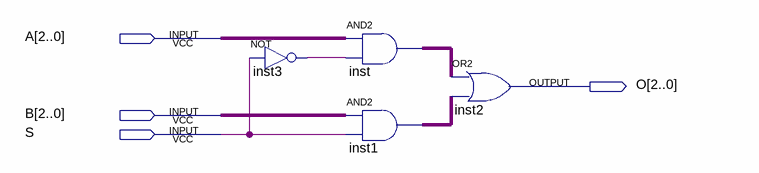
[diagram p0: schematic sheet]
// Quartus schematic 5mux21.bdf as structural Verilog: 4 symbols, 4 pins
module \5mux21  (
  input  [2:0] A,
  input  [2:0] B,
  input  S,
  output [2:0] O
);

  wire inst3_out;
  wire [2:0] inst1_out, inst_out;

  not inst3 (inst3_out, S);
  assign inst_out = A & {3{inst3_out}};  // AND2 inst, 3 bits wide
  assign inst1_out = B & {3{S}};  // AND2 inst1, 3 bits wide
  assign O = inst_out | inst1_out;  // OR2 inst2, 3 bits wide
endmodule
